# EAGLE design HIJACK_LQPF_D (EAGLE 5.10)
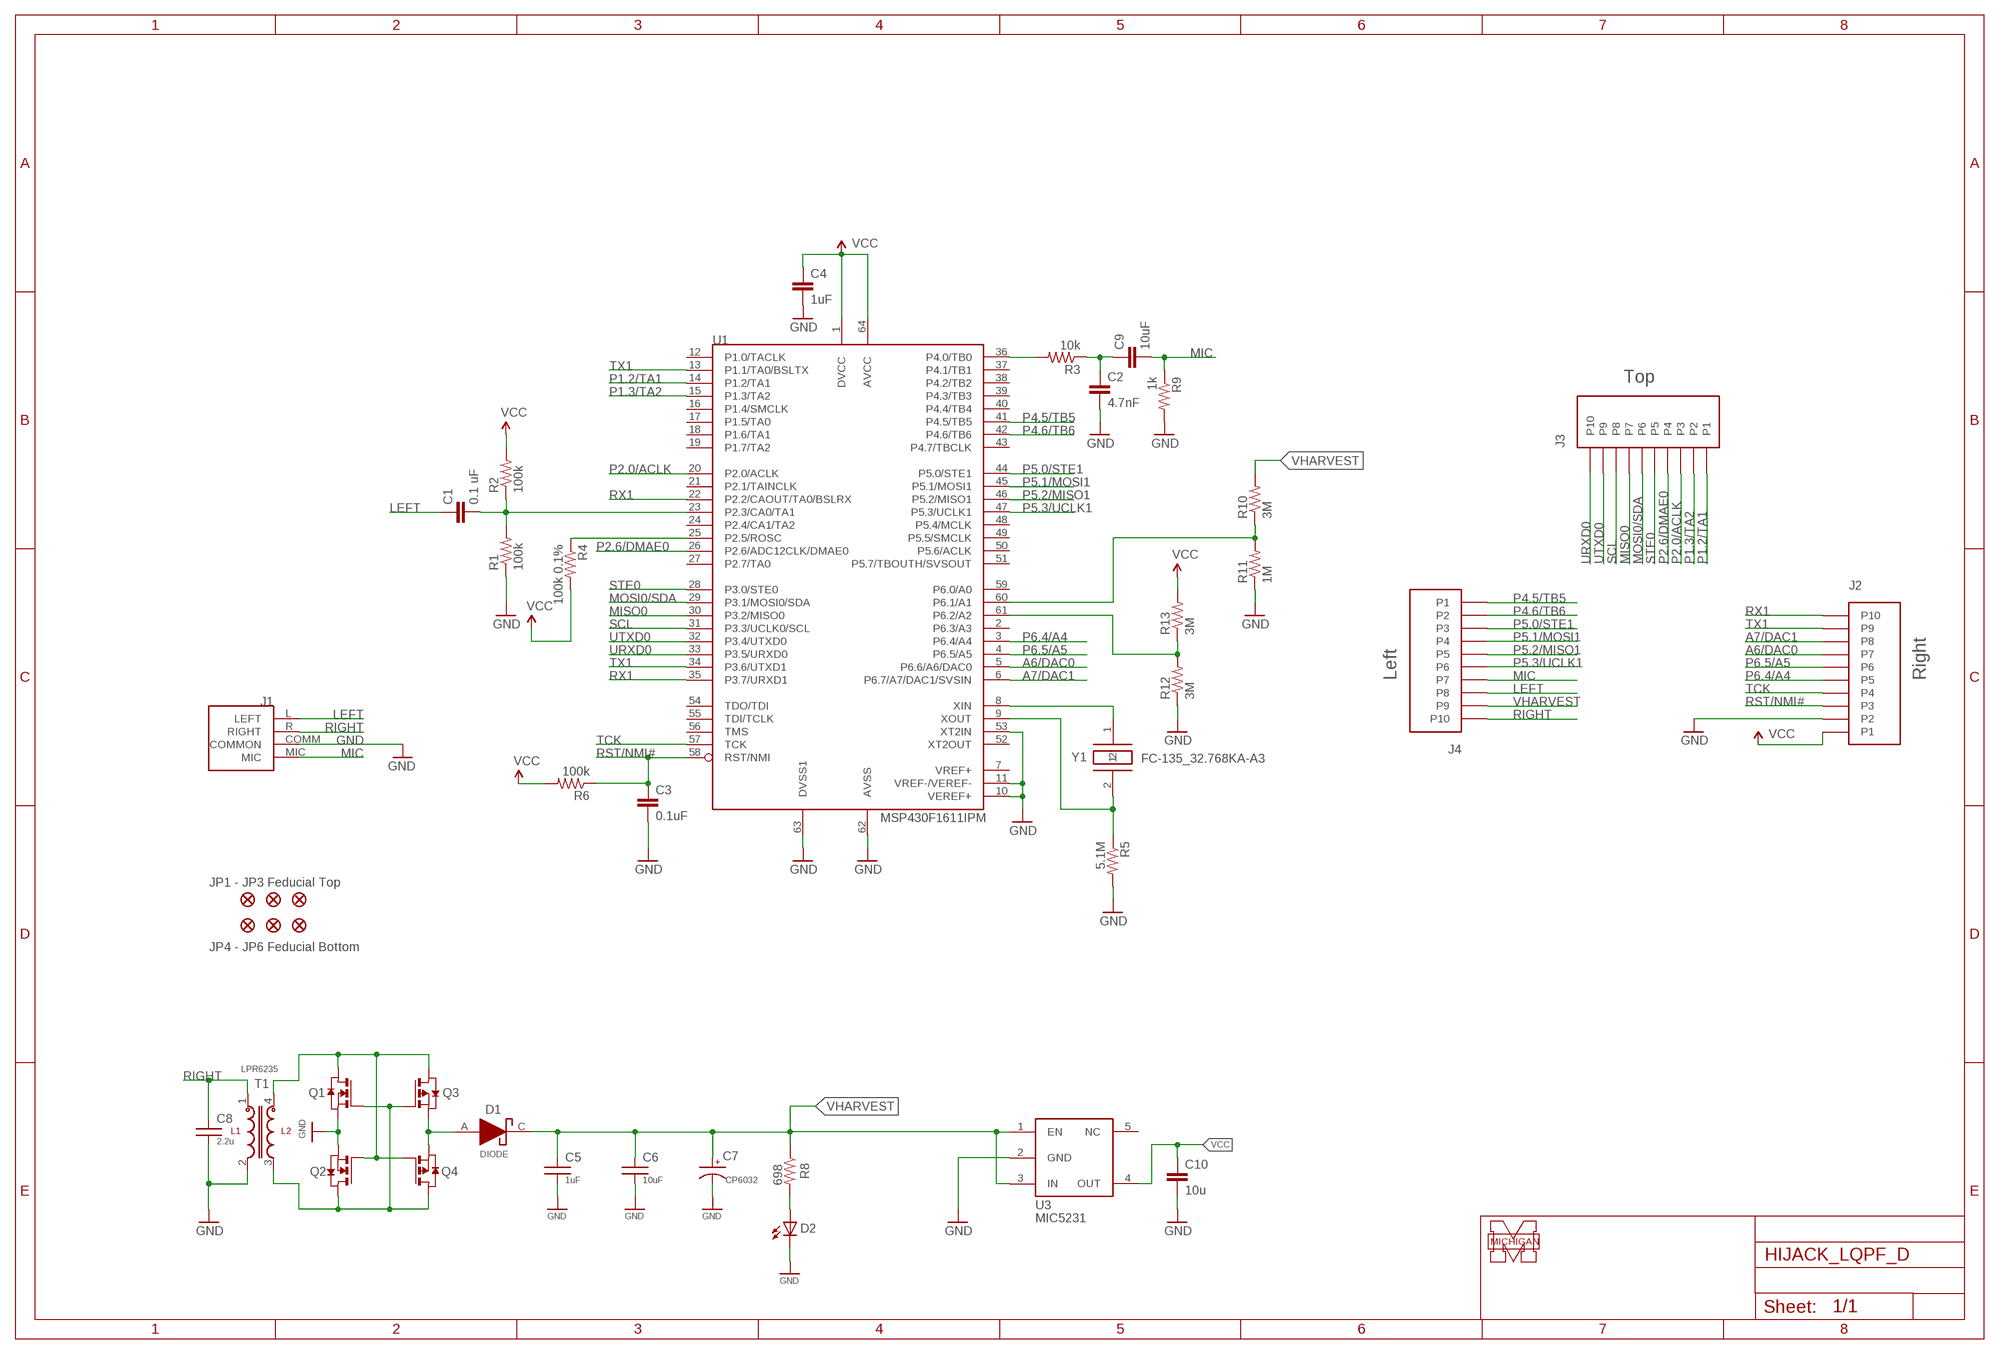
[diagram p0: schematic, sheet 1]

## Parts
C1  0.1 uF  CAP0603-CAP  [0603-CAP]
C2  4.7nF  CAP0603-CAP  [0603-CAP]
C3  0.1uF  CAP0603-CAP  [0603-CAP]
C4  1uF  CAP0603-CAP  [0603-CAP]
C5  1uF  C0603  [C0603]
C6  10uF  C0603  [C0603]
C7  CP6032  [CT6032]
C8  2.2u  C0603  [C0603]
C9  10uF  CAP0603-CAP  [0603-CAP]
C10  10u  C-EUC0603  [C0603]
D1  DIODE  [MINIMELF]
D2  LED0603  [LED-0603]
J1  3.5JACK4CONNSUNSTONE_QUICKTURN  [PLUGBOARDCONNECTOR_SUNSTONE]
J2  HEADER10POS  [10PIN2MMHEADER]
J3  HEADER10POS  [10PIN2MMHEADER]
J4  HEADER10POS  [10PIN2MMHEADER]
JP1  FIDUCIAL1X2  [FIDUCIAL-1X2]
JP2  FIDUCIAL1X2  [FIDUCIAL-1X2]
JP3  FIDUCIAL1X2  [FIDUCIAL-1X2]
JP4  FIDUCIAL1X2  [FIDUCIAL-1X2]
JP5  FIDUCIAL1X2  [FIDUCIAL-1X2]
JP6  FIDUCIAL1X2  [FIDUCIAL-1X2]
Q1  NMOSSOT23  [SOT-23]
Q2  NMOSSOT23  [SOT-23]
Q3  PMOSSOT23  [SOT-23]
Q4  PMOSSOT23  [SOT-23]
R1  100k  RESISTOR0603-RES  [0603-RES]
R2  100k  RESISTOR0603-RES  [0603-RES]
R3  10k  RESISTOR0603-RES  [0603-RES]
R4  100k 0.1%  RESISTOR0603-RES  [0603-RES]
R5  5.1M  RESISTOR0603-RES  [0603-RES]
R6  100k  RESISTOR0603-RES  [0603-RES]
R8  698  R-US_R0603  [R0603]
R9  1k  RESISTOR0603-RES  [0603-RES]
R10  3M  RESISTOR0603-RES  [0603-RES]
R11  1M  RESISTOR0603-RES  [0603-RES]
R12  3M  RESISTOR0603-RES  [0603-RES]
R13  3M  RESISTOR0603-RES  [0603-RES]
T1  LPR6235  [LPR6235]
U1  MSP430F1611IPM  [PM/PAG64]
U3  MIC5231  [SOT23-5]
Y1  FC-135_32.768KA-A3  [FC-135]

## Nets
A6/DAC0: J2.P7 U1.5(P6.6/A6/DAC0)
A7/DAC1: J2.P8 U1.6(P6.7/A7/DAC1/SVSIN)
GND: C2.2 C3.2 C4.2 C5.2 C6.2 C7.- C8.2 C10.2 D2.C J1.COMM(COMMON) J2.P2 Q1.2(S) Q2.2(S) R1.1 R5.2 R9.2 R11.1 R12.1 T1.2 U1.10(VEREF+) U1.11(VREF-/VEREF-) U1.53(XT2IN) U1.62(AVSS) U1.63(DVSS1) U3.2(GND)
LEFT: C1.1 J1.L(LEFT) J4.P8
MIC: C9.2 J1.MIC J4.P7 R9.1
MISO0: J3.P7 U1.30(P3.2/MISO0)
MOSI0/SDA: J3.P6 U1.29(P3.1/MOSI0/SDA)
N$1: C1.2 R1.2 R2.1 U1.23(P2.3/CA0/TA1)
N$2: R12.2 R13.1 U1.61(P6.2/A2)
N$3: R10.1 R11.2 U1.60(P6.1/A1)
N$4: R4.1 U1.25(P2.5/ROSC)
N$5: U1.8(XIN) Y1.1
N$7: R3.2 U1.36(P4.0/TB0)
N$8: Q1.1(D) Q2.3(G) Q3.1(D) Q4.3(G) T1.4
N$9: Q1.3(G) Q2.1(D) Q3.3(G) Q4.1(D) T1.3
N$10: R5.1 U1.9(XOUT) Y1.2
N$11: D2.A R8.2
N$12: C2.1 C9.1 R3.1
N$17: D1.A Q3.2(S) Q4.2(S)
P1.2/TA1: J3.P1 U1.14(P1.2/TA1)
P1.3/TA2: J3.P2 U1.15(P1.3/TA2)
P2.0/ACLK: J3.P3 U1.20(P2.0/ACLK)
P2.6/DMAE0: J3.P4 U1.26(P2.6/ADC12CLK/DMAE0)
P4.5/TB5: J4.P1 U1.41(P4.5/TB5)
P4.6/TB6: J4.P2 U1.42(P4.6/TB6)
P5.0/STE1: J4.P3 U1.44(P5.0/STE1)
P5.1/MOSI1: J4.P4 U1.45(P5.1/MOSI1)
P5.2/MISO1: J4.P5 U1.46(P5.2/MISO1)
P5.3/UCLK1: J4.P6 U1.47(P5.3/UCLK1)
P6.4/A4: J2.P5 U1.3(P6.4/A4)
P6.5/A5: J2.P6 U1.4(P6.5/A5)
RIGHT: C8.1 J1.R(RIGHT) J4.P10 T1.1
RST/NMI#: C3.1 J2.P3 R6.1 U1.58(RST/NMI)
RX1: J2.P10 U1.22(P2.2/CAOUT/TA0/BSLRX) U1.35(P3.7/URXD1)
SCL: J3.P8 U1.31(P3.3/UCLK0/SCL)
STE0: J3.P5 U1.28(P3.0/STE0)
TCK: J2.P4 U1.57(TCK)
TX1: J2.P9 U1.13(P1.1/TA0/BSLTX) U1.34(P3.6/UTXD1)
URXD0: J3.P10 U1.33(P3.5/URXD0)
UTXD0: J3.P9 U1.32(P3.4/UTXD0)
VCC: C4.1 C10.1 J2.P1 R2.2 R4.2 R6.2 R13.2 U1.1(DVCC) U1.64(AVCC) U3.4(OUT)
VHARVEST: C5.1 C6.1 C7.+ D1.C J4.P9 R8.1 R10.2 U3.1(EN) U3.3(IN)
Unconnected: U1.2(P6.3/A3) U1.7(VREF+) U1.12(P1.0/TACLK) U1.16(P1.4/SMCLK) U1.17(P1.5/TA0) U1.18(P1.6/TA1) U1.19(P1.7/TA2) U1.21(P2.1/TAINCLK) U1.24(P2.4/CA1/TA2) U1.27(P2.7/TA0) U1.37(P4.1/TB1) U1.38(P4.2/TB2) U1.39(P4.3/TB3) U1.40(P4.4/TB4) U1.43(P4.7/TBCLK) U1.48(P5.4/MCLK) U1.49(P5.5/SMCLK) U1.50(P5.6/ACLK) U1.51(P5.7/TBOUTH/SVSOUT) U1.52(XT2OUT) U1.54(TDO/TDI) U1.55(TDI/TCLK) U1.56(TMS) U1.59(P6.0/A0) U3.5(NC)

## Notes on the sheet
- Top
- Left | Right
- JP1 - JP3 Feducial Top
- JP4 - JP6 Feducial Bottom
- MICHIGAN

## Library data of the parts
C1-C4 C9 = SparkFun:CAP: Capacitor Standard 0603 ceramic capacitor, and 0.1" leaded capacitor.
C5 C6 C8 = umich:C
C7 = umich:CP
C10 = rcl:C-EU: CAPACITOR, European symbol
D1 = umich:DIODE
D2 = umich:LED: LEDs Standard schematic elements and footprints for 5mm, 3mm, 1206, and 0603 sized LEDs. 5mm - Spark Fun Electronics SKU : COM-00529 (and others)
J1 = Thomas:3.5JACK4CONN
J2-J4 = hijack:HEADER10POS: Fits 3M 950510-6102-AR
JP1-JP6 = SparkFun:FIDUCIAL: Fiducial Alignment Points Various fiducial points for machine vision alignment.
Q1 Q2 = zetex:NMOSSOT23: MOS FET
Q3 Q4 = zetex:PMOSSOT23: MOS FET
R1-R6 R9-R13 = SparkFun:RESISTOR: Resistor Basic schematic elements and footprints for 0603, 1206, and PTH 1/10th watt (small) resistors.
R8 = rcl:R-US_: RESISTOR, American symbol
T1 = umich:LPR6235
U1 = hijack:MSP430F1611
U3 = berkeley-epic:MIC5231
Y1 = berkeley-epic:FC-135_32.768KA-A3

## Board
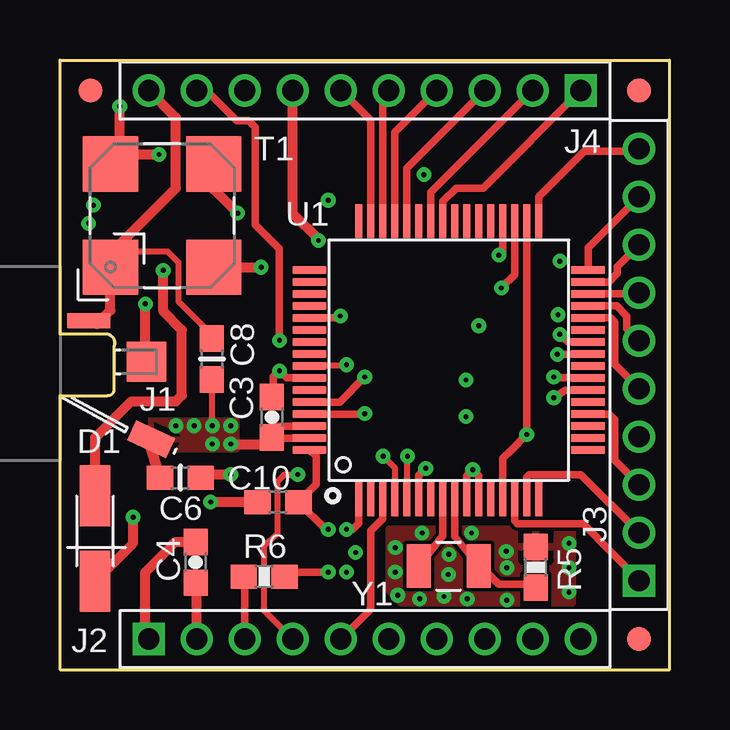
[diagram p1: board, top side]
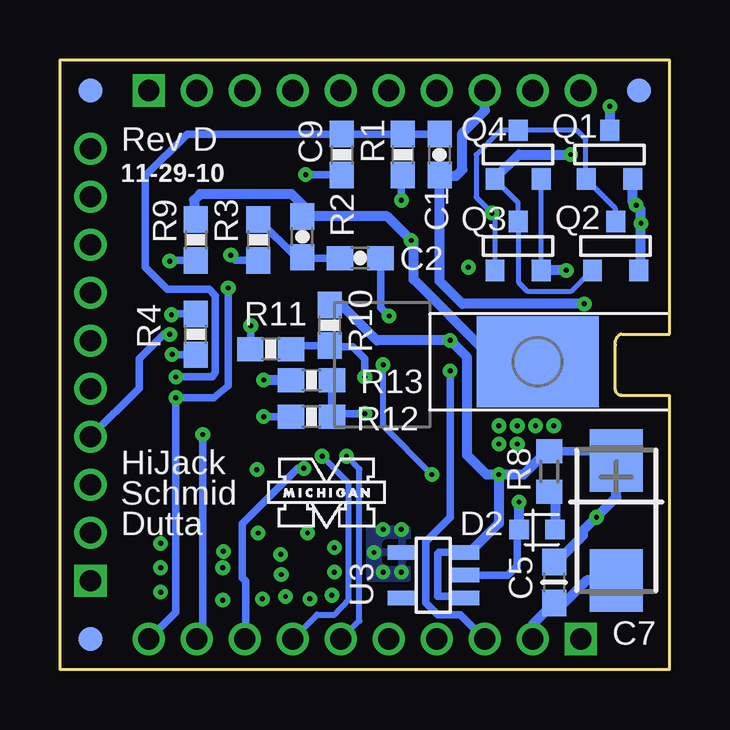
[diagram p2: board, bottom side, seen from below]

Size 25.4 x 25.4 mm. Coordinates in mm from the lower left corner, seen from the top.
Outline: 0,10.87 0,0 25.4,0 25.4,25.4 0,25.4 0,14.47
Copper layers (1+2*15+16): Top 0.0178mm / dielectric 0.3048mm / $GND 0.0356mm / dielectric 0.7112mm / $VCC 0.0356mm / dielectric 0.3048mm / Bottom 0.0178mm
Design rules "SSC-EAGLE-4Lyr_v1.0.0.3 *": minimum track width 6mil, minimum drill 8mil, track to track 6mil, track to pad 6mil, pad to pad 6mil, via to via 6mil, smd to smd 6mil, copper to edge 20mil, drill to drill 16mil, minimum pad ring 8mil, minimum via ring 8mil, stop-mask expansion 3mil, vias tented up to drill 10mil, thermal gap 10mil

### Footprints (pad centres in the part's own frame; a part is rotated, then mirrored left to right if it is on the bottom)
0603-CAP = smd 1.1 x 1: 1 -0.85,0; 2 0.85,0
C0603 = smd 1.1 x 1: 1 -0.85,0; 2 0.85,0
CT6032 = smd 2.6 x 2.2: + -2.5,0; - 2.5,0
MINIMELF = smd 2.54 x 1.27: A -1.778,0; C 1.778,0
LED-0603 = smd 0.8 x 0.8: A 0,-0.75; C 0,0.75
PLUGBOARDCONNECTOR_SUNSTONE = smd 1.778 x 0.914 rotated 155: COMM 3.799,-3.103 | smd 1.651 x 1.651: L 3.601,0.127 | smd 5.08 x 3.81 bottom: MIC 5.501,0.127 | smd 1.778 x 0.635: R 1.201,1.833
10PIN2MMHEADER = drill 0.89 pad 1.346 square: P1 -9,0 | drill 0.89 pad 1.346 round: P2 -7,0; P3 -5,0; P4 -3,0; P5 -1,0; P6 1,0; P7 3,0; P8 5,0; P9 7,0; P10 9,0
FIDUCIAL-1X2 = smd 1 x 1: 1 0,0
SOT-23 = smd 0.787 x 0.889: 1 0.025,-1.016; 2 -0.94,1.016; 3 0.991,1.016
0603-RES = smd 1.1 x 1: 1 -0.85,0; 2 0.85,0
R0603 = smd 1 x 1.1: 1 -0.85,0; 2 0.85,0
LPR6235 = smd 2.3 x 2.3: 1 -2.15,2.15; 2 -2.15,-2.15; 3 2.15,-2.15; 4 2.15,2.15
PM/PAG64 = smd 1.4 x 0.3: 1 -5.8,3.75; 2 -5.8,3.25; 3 -5.8,2.75; 4 -5.8,2.25; 5 -5.8,1.75; 6 -5.8,1.25; 7 -5.8,0.75; 8 -5.8,0.25; 9 -5.8,-0.25; 10 -5.8,-0.75; 11 -5.8,-1.25; 12 -5.8,-1.75; 13 -5.8,-2.25; 14 -5.8,-2.75; 15 -5.8,-3.25; 16 -5.8,-3.75; 33 5.8,-3.75; 34 5.8,-3.25; 35 5.8,-2.75; 36 5.8,-2.25; 37 5.8,-1.75; 38 5.8,-1.25; 39 5.8,-0.75; 40 5.8,-0.25; 41 5.8,0.25; 42 5.8,0.75; 43 5.8,1.25; 44 5.8,1.75; 45 5.8,2.25; 46 5.8,2.75; 47 5.8,3.25; 48 5.8,3.75 | smd 0.3 x 1.4: 17 -3.75,-5.8; 18 -3.25,-5.8; 19 -2.75,-5.8; 20 -2.25,-5.8; 21 -1.75,-5.8; 22 -1.25,-5.8; 23 -0.75,-5.8; 24 -0.25,-5.8; 25 0.25,-5.8; 26 0.75,-5.8; 27 1.25,-5.8; 28 1.75,-5.8; 29 2.25,-5.8; 30 2.75,-5.8; 31 3.25,-5.8; 32 3.75,-5.8; 49 3.75,5.8; 50 3.25,5.8; 51 2.75,5.8; 52 2.25,5.8; 53 1.75,5.8; 54 1.25,5.8; 55 0.75,5.8; 56 0.25,5.8; 57 -0.25,5.8; 58 -0.75,5.8; 59 -1.25,5.8; 60 -1.75,5.8; 61 -2.25,5.8; 62 -2.75,5.8; 63 -3.25,5.8; 64 -3.75,5.8
SOT23-5 = smd 0.6 x 1.2: 1 -0.95,-1.306; 2 0,-1.306; 3 0.95,-1.306; 4 0.95,1.306; 5 -0.95,1.306
FC-135 = smd 1 x 1.8: 1 -1.25,0; 2 1.25,0

### Placement (x,y rotation side)
C1  9.59,21.46 90 bottom
C2  12.89,17.14 0 bottom
C3  8.83,10.51 270 top
C4  5.65,4.47 270 top
C5  4.81,3.63 270 bottom
C6  5.02,8 180 top
C7  2.22,6.22 270 bottom
C8  6.33,12.94 270 top
C9  15.3,18.03 90 bottom
C10  9.08,6.98 180 top
D1  1.46,5.46 270 top
D2  5.52,5.84 90 bottom
J1  0,12.7 0 top
J2  12.7,1.27 0 top
J3  24.13,12.7 90 top
J4  12.7,24.13 180 top
JP1  24.13,1.27 0 top
JP2  1.27,24.13 0 top
JP3  24.13,24.13 0 top
JP4  1.27,24.13 0 bottom
JP5  24.13,1.27 0 bottom
JP6  24.13,24.13 0 bottom
Q1  2.48,21.46 180 bottom
Q2  2.22,17.65 180 bottom
Q3  6.29,17.65 180 bottom
Q4  6.29,21.46 180 bottom
R1  11.11,21.46 90 bottom
R2  13.65,21.46 270 bottom
R3  17.13,17.9 270 bottom
R4  19.75,13.97 90 bottom
R5  19.82,4.26 90 top
R6  8.51,3.87 0 top
R8  5.02,8.25 270 bottom
R9  19.75,17.9 270 bottom
R10  14.16,14.35 90 bottom
R11  16.62,13.36 0 bottom
R12  14.92,10.54 0 bottom
R13  14.92,12.06 180 bottom
T1  4.25,18.92 90 top
U1  16.2,12.9 90 top
U3  9.84,3.93 90 bottom
U$2  [UMICH]  16.83,5.71 0 bottom
Y1  16.19,4.32 0 top

### Tracks (layer width: path | path; a pad name or v marks a point on that pad's centre or on a via)
A6/DAC0  (via drill 0.2)
  Top 0.254: 14.45,8.89 U1.5
  Top 0.305: v14.48,8.89 14.45,8.89
  Bottom 0.254: J2.P7 14.68,2.29 13.97,2.29 13.36,2.92 13.36,7.77 v14.48,8.89
A7/DAC1  (via drill 0.2)
  Top 0.305: U1.6 14.95,8.09 v15.24,8.38
  Bottom 0.305: v15.24,8.38 15.49,8.38 17.8,6.07 17.8,3.83 17.65,3.68 17.65,1.32 J2.P8
GND  (via drill 0.2)
  Top 0.254: C8.2 6.33,10.18 v6.35,10.16 | J1.COMM 3.66,9.6
  Top 0.305: C3.2 U1.63 | v16.92,10.54 16.87,10.54 16.82,10.49 | U1.10 16.95,8.09 v17.2,8.33 17.45,8.08 U1.11 | U1.62 8.82,10.15 C3.2 | U1.53 11.68,14.65 v11.68,14.73
  Top 0.406: C10.2 v6.27,6.99 | v7.11,9.4 8.56,9.4 C3.2 | T1.2 v8.38,16.77 v8.38,16.76 | J2.P2 5.7,3.62 C4.2 | 3.66,9.6 C6.2
  Bottom 0.203: Q2.2 1.21,16.63
  Bottom 0.254: v1.4,19.36 1.4,19.24 1.21,19.05
  Bottom 0.305: U3.2 6.73,3.93 6.35,4.32 6.35,5.76 D2.C | R9.2 20.79,17.05 v20.83,17.02 | R11.1 v17.45,14.33 | R12.1 v16.91,10.54 v16.92,10.54 | R1.1 11.18,20.61 v11.18,19.56 | C2.2 12.04,15.09 v11.68,14.73
  Bottom 0.406: Q1.2 1.54,19.5 1.21,19.17 1.21,19.05 1.21,16.63 | C7.- 3.45,3.72 4.59,2.58 C5.2 5.7,1.89 J2.P2 | Q2.2 1.28,16.71 | v6.27,6.99 v6.27,6.98 D2.C
  other vias: 1.19,18.59 4.83,10.16 5.59,10.16 7.11,10.16 6.35,9.4 14.07,3.1 14.99,2.95 16,3.05 16.97,2.95 18.62,2.9 18.59,4.93 17.14,5.69 16.18,3.96 16.21,4.8 13.97,4.06 13.97,5.08 15.09,5.69 18.62,4.24 21.21,5.26 21.21,4.24 21.21,3.23
  pour Top: 3.05,10.41 7.37,10.41 7.37,9.14 3.05,9.14
  pour Top: 13.72,5.84 13.72,3.3 14.22,2.79 21.34,2.79 21.34,5.84
LEFT  (via drill 0.2)
  Top 0.254: 3.56,12.72 3.56,12.78 J1.L
  Top 0.406: 3.56,12.72 v3.56,15.24
  Bottom 0.406: v3.56,15.24 8.64,15.24 9.59,16.19 C1.1 9.55,20.57 8.89,20.57 8.64,20.83 8.64,22.35 7.7,23.29 J4.P8
MIC  (via drill 0.2)
  Top 0.305: v10.77,17.88 10.79,17.91
  Top 0.406: J4.P7 9.7,19 10.79,17.91
  Bottom 0.254: J1.MIC 6.89,12.83 7.01,12.7
  Bottom 0.406: R9.1 19.81,18.82 19.81,19.56 19.56,19.81 15.75,19.81 15.3,19.37 C9.2 11.77,18.88 v10.77,17.88 10.67,17.78 10.67,16.26 7.62,13.21 7.49,13.18 7.01,12.7
MISO0
  Top 0.305: U1.30 24.08,15.65 J3.P7
MOSI0/SDA
  Top 0.305: U1.29 23.2,15.15 23.62,14.73 23.62,14.21 J3.P6
N$1  (via drill 0.2)
  Top 0.305: v20.57,12.19 20.62,12.15 U1.23
  Bottom 0.305: C1.2 R1.2 R2.1 20.11,22.31 21.84,20.57 21.84,16.76 20.93,15.85 19.18,15.85 18.92,15.57 18.92,12.39 19.05,12.19 v20.57,12.19
N$2  (via drill 0.2)
  Top 0.305: U1.61 12.68,10.65 v12.7,10.67
  Bottom 0.305: v12.7,10.67 13.94,10.67 R12.2 R13.1
N$3  (via drill 0.2)
  Top 0.305: U1.60 11.66,11.15 v12.7,12.19
  Bottom 0.305: v12.7,12.19 12.7,12.95 13.21,13.46 14.12,13.46 R10.1 15.68,13.5 R11.2
N$4  (via drill 0.2)
  Top 0.305: v20.73,13.13 21.98,13.13 U1.25
  Bottom 0.305: R4.1 20.66,13.12 v20.73,13.13
N$5
  Top 0.305: Y1.1 15.95,5.58 U1.8
N$7  (via drill 0.2)
  Top 0.305: v18.29,17.27 18.45,17.43 U1.36
  Bottom 0.305: R3.2 18.07,17.05 v18.29,17.27
N$8  (via drill 0.2)
  Top 0.406: v4.13,21.46 2.49,21.46 | 2.49,21.46 T1.4 | 2.49,21.46 v2.49,23.46 v2.49,23.47
  Bottom 0.203: Q4.3 7.3,20.44 6.31,19.45 Q3.1 6.29,18.67 6.29,16.13 5.9,15.74 4.13,15.74 3.24,16.63 Q2.3
  Bottom 0.406: Q4.3 7.28,20.47 6.29,21.46 v4.13,21.46 | v2.49,23.47 2.49,22.49 Q1.1
N$9  (via drill 0.2)
  Top 0.406: T1.3 6.4,20.01 v7.4,19.02
  Bottom 0.203: 3.49,20.44 Q1.3 | Q2.1 2.25,19.2 3.49,20.44 | Q3.3 7.28,18.89 v7.4,19.02 8.06,19.68 8.06,21.46 7.05,22.48 Q4.1 3.87,22.48 3.49,22.09 3.49,20.44
N$10
  Top 0.305: U1.9 16.45,5.56 Y1.2 17.53,4.32 18.29,3.56 19.53,3.56 R5.1
N$11
  Bottom 0.406: 4.77,5.95 D2.A 4.77,7.4 R8.2
N$12
  Bottom 0.305: C2.1 15.26,17.14 C9.1 15.56,17.18 R3.1
N$17  (via drill 0.2)
  Top 0.406: D1.A 1.46,9.66 2.97,11.18 4.83,11.18 5.08,11.43 5.08,14.15 4.3,14.92 v4.3,16.63
  Bottom 0.203: Q3.2 Q4.2 5.35,20.5 5.27,20.57
  Bottom 0.406: v4.3,16.63 Q3.2
P1.2/TA1
  Top 0.305: U1.14 18.95,6.2 19.05,6.07 21.79,6.07 J3.P1
P1.3/TA2
  Top 0.305: U1.15 19.45,8.02 19.56,8.13 21.7,8.13 J3.P2
P2.0/ACLK
  Top 0.305: U1.20 22.88,10.65 23.11,10.41 23.11,8.72 J3.P3
P2.6/DMAE0  (via drill 0.2)
  Top 0.305: v20.83,13.97 21.15,13.65 U1.26
  Bottom 0.305: J3.P4 22.1,11.73 22.1,12.95 21.08,13.97 v20.83,13.97
P4.5/TB5
  Top 0.305: U1.41 15.95,19.51 16.51,20.07 17.64,20.07 J4.P1
P4.6/TB6
  Top 0.305: U1.42 15.45,19.88 J4.P2
P5.0/STE1
  Top 0.305: U1.44 14.45,20.88 J4.P3
P5.1/MOSI1
  Top 0.305: U1.45 13.95,22.38 J4.P4
P5.2/MISO1
  Top 0.305: U1.46 13.45,23.88 J4.P5
P5.3/UCLK1
  Top 0.305: U1.47 12.95,22.88 J4.P6
P6.4/A4
  Top 0.305: U1.3 13.45,6.29 12.95,5.79 12.95,2.52 J2.P5
P6.5/A5  (via drill 0.2)
  Top 0.254: U1.4 13.95,8.4 v13.46,8.89
  Bottom 0.254: J2.P6 13.7,1.29 12.93,2.03 12.93,8.36 v13.46,8.89
RIGHT
  Top 0.254: J1.R 1.42,14.53 1.54,14.41 | C8.1 6.33,13.94 4.93,15.34 4.93,16.97 4.47,17.42 2.21,17.42 2.2,17.44
  Top 0.406: J4.P10 4.83,23 4.83,20.07 2.2,17.44 2.1,17.34 T1.1 2.1,14.97 1.54,14.41
RST/NMI#  (via drill 0.2)
  Top 0.305: R6.1 7.7,3.83 J2.P3 | C3.1 8.89,11.43 8.89,12.19 v9.14,12.45 9.44,12.15 U1.58
  Bottom 0.305: J2.P3 8.72,2.29 9.65,2.29 10.16,2.79 10.16,5.33 9.14,6.35 v9.14,12.45
RX1  (via drill 0.2)
  Top 0.305: U1.22 21.05,11.65 v20.57,11.33 | U1.35 18.95,16.46 v18.39,15.9
  Bottom 0.305: J2.P10 20.57,2.4 v20.57,11.33 19,11.33 18.39,11.84 v18.39,15.9
SCL
  Top 0.305: U1.31 22.86,16.15 23.22,16.51 23.22,16.79 J3.P8
STE0
  Top 0.305: U1.28 22.94,14.65 23.11,14.48 23.11,12.72 J3.P5
TCK  (via drill 0.2)
  Top 0.254: J2.P4 8.51,2.46 8.51,5.13 9.07,5.69 9.07,7.85 9.35,8.13 v9.91,8.13 | v11.94,12.7 11.89,12.65 U1.57
  Bottom 0.254: v9.91,8.13 11.94,10.16 v11.94,12.7
TX1  (via drill 0.2)
  Top 0.305: U1.34 v19.45,9.8 18.8,9.14 18.45,8.8 U1.13
  Bottom 0.305: J2.P9 19.45,1.27 v19.45,9.8
URXD0
  Top 0.305: U1.33 19.95,19.7 21.84,21.59 24.02,21.59 J3.P10
UTXD0
  Top 0.305: U1.32 22,17.57 J3.P9
VCC  (via drill 0.2)
  Top 0.305: R6.2 9.54,4.06 v11.18,4.06 | v11.18,5.84 11.07,5.84 C10.1 10.67,7.72 10.67,8.88 U1.64 | U1.1 12.45,6.09 12.2,5.84 v11.94,5.84
  Top 0.406: J2.P1 3.56,1.41 3.56,4.06 4.28,4.78 4.81,5.32 C4.1 | v16.92,12.06 16.99,12.06
  Bottom 0.305: R2.2 14.7,20.61 v15.16,20.62 | v20.75,14.78 20.72,14.82 R4.2
  Bottom 0.406: R13.2 v16.92,12.06
  other vias: 12.32,4.88 11.94,4.06
  pour Bottom: 10.92,5.84 10.92,3.81 12.5,3.81 12.5,5.84
VHARVEST  (via drill 0.2)
  Top 0.305: J4.P9 6.1,24.13 7.37,22.86 7.87,22.86 8.13,22.61 8.13,18.54 9.14,17.53 v9.14,13.72
  Top 0.406: D1.C 3.05,5.27 v3.05,6.35 | C6.1 6,8.13 v7.11,8.13
  Bottom 0.254: C7.+ 3.11,9.1
  Bottom 0.305: U3.1 8.6,3.05 9.65,3.05 9.65,4.83 9.59,4.88 U3.3 8.32,4.88
  Bottom 0.356: U3.1 8.6,2.92 | 3.11,9.1 R8.1
  Bottom 0.406: 4.89,4.32 3.62,5.58 3.62,5.78 v3.05,6.35 2.22,7.18 C7.+ | 8.32,4.88 7.11,6.1 v7.11,8.13 | R10.2 13.67,15.2 12.19,13.72 v9.14,13.72 8.43,13.01 8.43,8.94 7.62,8.13 v7.11,8.13 | v7.11,8.13 6.1,8.13 5.12,9.1 R8.1
  Bottom 0.508: 4.89,4.32 4.93,4.28 C5.1

### Text on the board
bPlace: Rev D | 11-29-10 | HiJack | Schmid | Dutta